# Altium project BV100011_UniversalSlave.PrjPCB (part 2 of 2)

## Sheet BV100011_SDCARD.SchDoc
size A
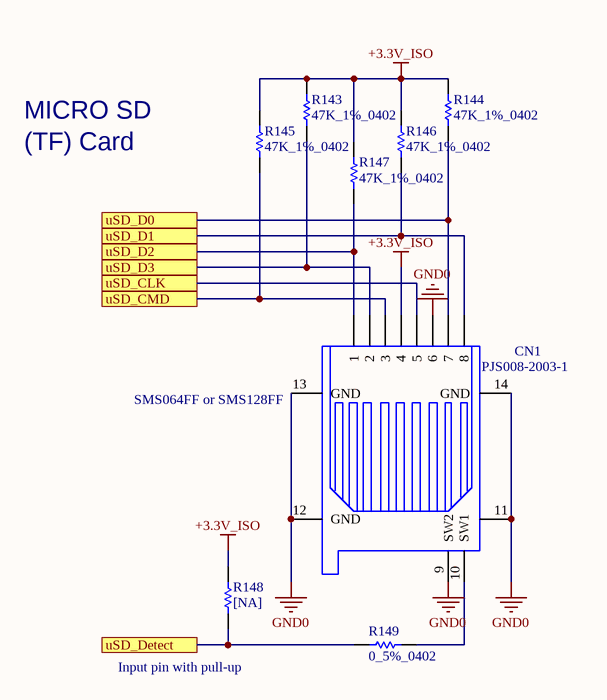
[diagram p9: BV100011_SDCARD.SchDoc]

### Parts
CN1  PJS008-2003-1  [PJS008-2003-1]
R143  47K_1%_0402  [0402R]
R144  47K_1%_0402  [0402R]
R145  47K_1%_0402  [0402R]
R146  47K_1%_0402  [0402R]
R147  47K_1%_0402  [0402R]
R148  [NA]  [0402R]
R149  0_5%_0402  [0402R]

### Ports
uSD_CLK, uSD_CMD, uSD_D0, uSD_D1, uSD_D2, uSD_D3, uSD_Detect

### Nets
+3.3V_ISO: CN1.4 R143.2 R144.2 R145.2 R146.2 R147.2 R148.2
GND0: CN1.6 CN1.9(SW2) CN1.11(GND) CN1.12(GND) CN1.13(GND) CN1.14(GND)
PC8: CN1.7 R144.1 ; port uSD_D0
PC9: CN1.8 R146.1 ; port uSD_D1
PC10: CN1.1 R147.1 ; port uSD_D2
PC11: CN1.2 R143.1 ; port uSD_D3
PC12: CN1.5 ; port uSD_CLK
PD2: CN1.3 R145.1 ; port uSD_CMD
PD3: R148.1 R149.1 ; port uSD_Detect
NetCN1_10: CN1.10(SW1) R149.2

### Notes on the sheet
- MICRO SD
- (TF) Card
- (near CN1) SMS064FF or SMS128FF
- (near R148) Input pin with pull-up

### Library data of the parts
CN1 = microSD-PJS008-2003: Memory Card Connectors MicroSD Card Conn Revrs Mnt Push-Push; Manuf_1: YAMAICHI; Manuf_Part_1: PJS008-2003-1; ECCN_US/EU: N/A; Order: PJS008-2003-1
R143-R147 = Res_47K_1%_0402: Resistor,47K,0402,1%,YAGEO; Manuf_Part_1: RC0402FR-0747KL; Order: 9239430; Value: 47K; Manuf_1: YAGEO; ECCN_US/EU: n/a; Distrib: FARNELL
R148 = Res_NA_0402: Resistor,[NA],0402; Fitted: NO; Value: [NA]; ECCN_US/EU: n/a
R149 = Res_0_5%_0402: Resistor,0,0402,5%,YAGEO; Manuf_Part_1: RC0402JR-070RL; Value: 0; Order: 2363467; ECCN_US/EU: n/a; Manuf_1: YAGEO; Distrib: FARNELL

## Sheet BV100011_Ethernet.SchDoc: Ethernet PHY with RJ45 connector
size A4; Date: 25-FEB-2015; Author: A.B; CompanyName: STMicroelectronics; Address1: 12, Rue Jules HOROWITZ; Address2: 38019 Grenoble; Address3: FRANCE; DocumentNumber: MB1191; Revision: B-02; SheetNumber: 12; SheetTotal: 14; Project: STM32F746G-DISCO
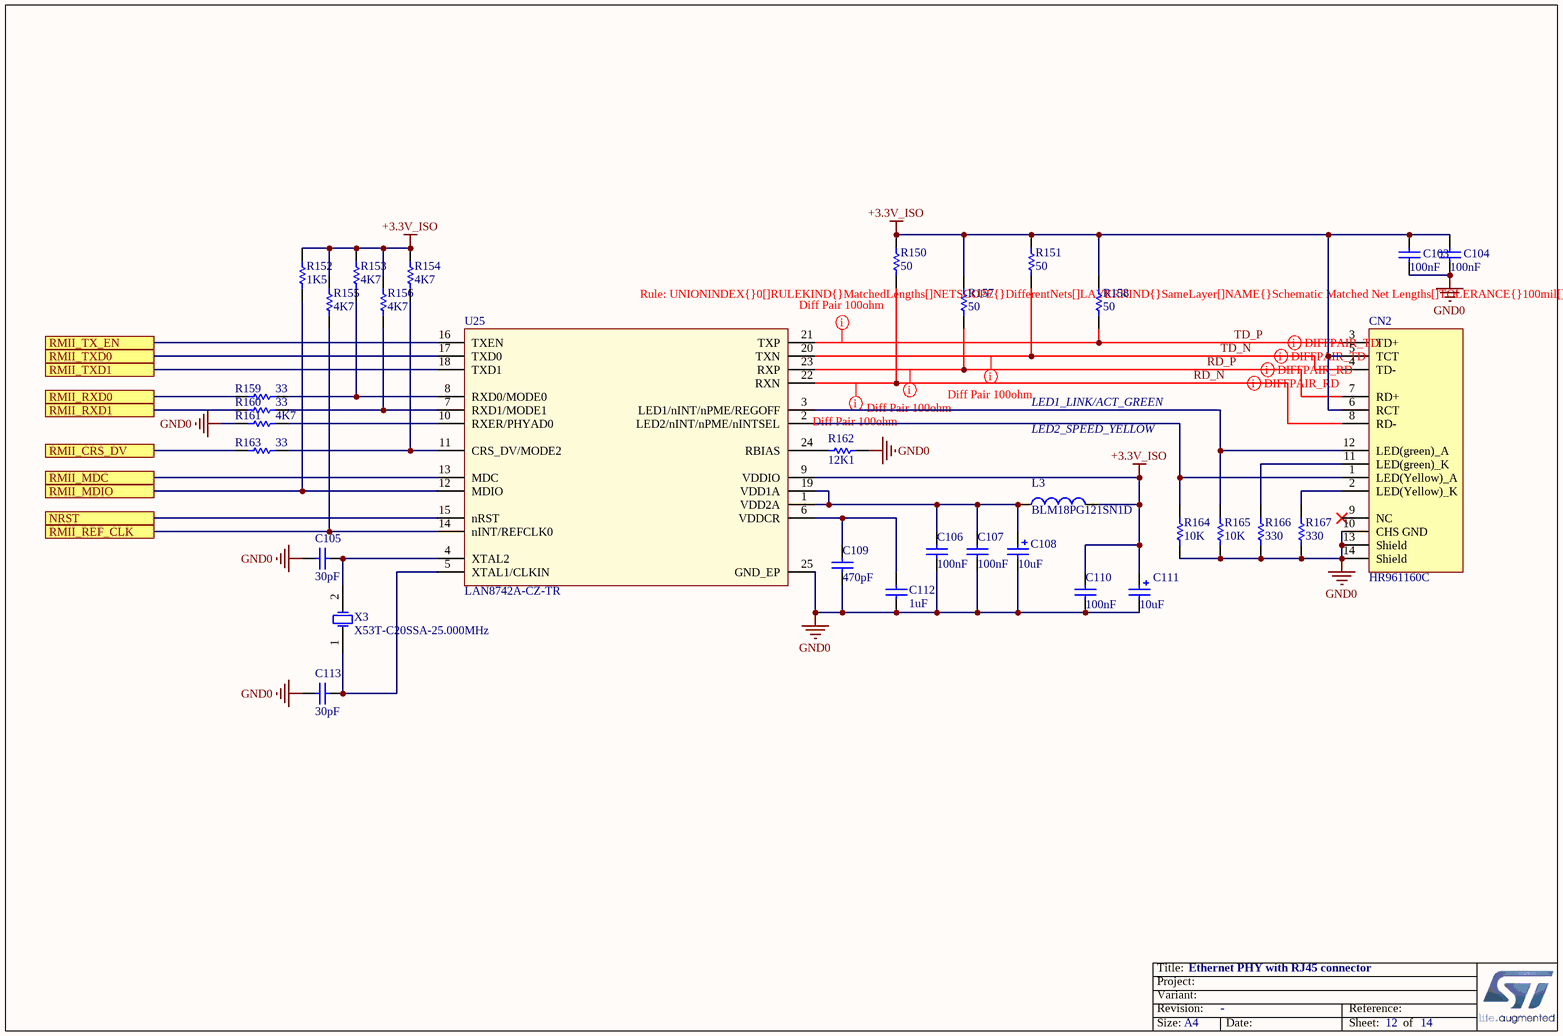
[diagram p10: BV100011_Ethernet.SchDoc]

### Parts
C103  100nF  [0402C]
C104  100nF  [0402C]
C105  30pF  [0603C]
C106  100nF  [0402C]
C107  100nF  [0402C]
C108  10uF  [TAN-A]
C109  470pF  [0402C]
C110  100nF  [0402C]
C111  10uF  [TAN-A]
C112  1uF  [0603C]
C113  30pF  [0603C]
CN2  HR961160C  [RJ45_HR961160C]
L3  BLM18PG121SN1D  [0603L]
R150  50  [0402R]
R151  50  [0402R]
R152  1K5  [0402R]
R153  4K7  [0402R]
R154  4K7  [0402R]
R155  4K7  [0402R]
R156  4K7  [0402R]
R157  50  [0402R]
R158  50  [0402R]
R159  33  [0402R]
R160  33  [0402R]
R161  4K7  [0402R]
R162  12K1  [0603R]
R163  33  [0402R]
R164  10K  [0402R]
R165  10K  [0402R]
R166  330  [0402R]
R167  330  [0402R]
U25  LAN8742A-CZ-TR  [QFN24_0R5_4X4]
X3  X53T-C20SSA-25.000MHz  [XTAL_2SM_5R0X3R2]

### Ports
NRST, RMII_CRS_DV, RMII_MDC, RMII_MDIO, RMII_REF_CLK, RMII_RXD0, RMII_RXD1, RMII_TX_EN, RMII_TXD0, RMII_TXD1

### Nets
+3.3V_ISO: C103.2 C104.2 C110.2 C111.1 CN2.5(TCT) CN2.6(RCT) L3.2 R150.1 R151.1 R152.2 R153.2 R154.2 R155.2 R156.2 R157.1 R158.1 U25.9(VDDIO)
GND0: C103.1 C104.1 C105.2 C106.1 C107.1 C108.2 C109.1 C110.1 C111.2 C112.1 C113.2 CN2.10(CHS_GND) CN2.13(Shield) CN2.14(Shield) R161.2 R162.2 R164.1 R165.1 R166.1 R167.1 U25.25(GND_EP)
NRST: U25.15(nRST) ; port NRST
PA1: R155.1 U25.14(nINT/REFCLK0) ; port RMII_REF_CLK
PA2: R152.1 U25.12(MDIO) ; port RMII_MDIO
PA7: R163.2 ; port RMII_CRS_DV
PB13: U25.18(TXD1) ; port RMII_TXD1
PC1: U25.13(MDC) ; port RMII_MDC
PC4: R159.2 ; port RMII_RXD0
PC5: R160.2 ; port RMII_RXD1
PG11: U25.16(TXEN) ; port RMII_TX_EN
PG13: U25.17(TXD0) ; port RMII_TXD0
RD_N: CN2.8(RD-) R150.2 U25.22(RXN)
RD_P: CN2.7(RD+) R157.2 U25.23(RXP)
TD_N: CN2.4(TD-) R151.2 U25.20(TXN)
TD_P: CN2.3(TD+) R158.2 U25.21(TXP)
NetC105_1: C105.1 U25.4(XTAL2) X3.2(OSC2)
NetC106_2: C106.2 C107.2 C108.1 L3.1 U25.1(VDD2A) U25.19(VDD1A)
NetC109_2: C109.2 C112.2 U25.6(VDDCR)
NetC113_1: C113.1 U25.5(XTAL1/CLKIN) X3.1(OSC1)
NetCN2_1: CN2.1(LED(Yellow)_A) R164.2 U25.2(LED2/nINT/nPME/nINTSEL)
NetCN2_2: CN2.2(LED(Yellow)_K) R167.2
NetCN2_11: CN2.11(LED(green)_K) R166.2
NetCN2_12: CN2.12(LED(green)_A) R165.2 U25.3(LED1/nINT/nPME/REGOFF)
NetR153_1: R153.1 R159.1 U25.8(RXD0/MODE0)
NetR154_1: R154.1 R163.1 U25.11(CRS_DV/MODE2)
NetR156_1: R156.1 R160.1 U25.7(RXD1/MODE1)
NetR161_1: R161.1 U25.10(RXER/PHYAD0)
NetR162_1: R162.1 U25.24(RBIAS)

Not connected (* = marked no-connect by the designer): CN2 9(NC)*

### Layout directives
differential pair: RD_N, RD_P, TD_N, TD_P
rule Matched Net Lengths [Tolerance = 100mil]: RD_N, RD_P, TD_N, TD_P

### Notes on the sheet
- LED2_SPEED_YELLOW
- LED1_LINK/ACT_GREEN
- Title:
- Project:
- Size:
- Revision:
- Variant:
- A4
- -
- Date:
- Reference:
- Sheet:
- of

### Library data of the parts
C103 C104 C106 C107 C110 = Cap_100nF_X7R_10%_0402: Capacitor,100nF,16V,X7R,10%,0402,YAGEO; Manuf_Part_1: CC0402KRX7R7BB104; Revision: July-2002: Re-released for DXP Platform.; Value: 100nF; Order: CC0402KRX7R7BB104; Manuf_1: YAGEO
C105 C113 = Capacitor_ST: Capacitor 0402 / 0603 / 0805; Value: 100nF; Revision: July-2002: Re-released for DXP Platform.
C108 C111 = Cap_10uF_POL_10%_TANA: Polarized Capacitor,10uF,10V,10%,typeA,VISHAY; Manuf_Part_1: 293D106X9010A2TE3; Revision: July-2002: Re-released for DXP Platform.; Value: 10uF; Manuf_1: VISHAY; Order: *; ECCN_US/EU: n/a
C109 = Cap_470pF_X7R_10%_0402: Capacitor,470pF,16V,X7R,10%,0402,YAGEO; Manuf_Part_1: 0402YC471KAT4A; Manuf_1: AVX; Revision: July-2002: Re-released for DXP Platform.; Value: 470pF; Order: 0402YC471KAT4A; ECCN_US/EU: n/a
C112 = Cap_1uF_X5R_10%_0603: Capacitor,1uF,16V,X5R,10%,0603,YAGEO; Manuf_Part_1: CC0603KRX5R7BB105; Revision: July-2002: Re-released for DXP Platform.; Value: 1uF; Order: CC0603KRX5R7BB105; Manuf_1: YAGEO; ECCN_US/EU: n/a
CN2 = HR961160C: 100 Base-TX (Fast Ethernet) SMD RJ45 single port (1x1) with LEDS Integrated Magnetics Connector; Manuf_1: HanRun; Manuf_2: Pulse Electronics Corporation; Manuf_Part_2: J3011G21DNLT; Manuf_3: K.O.D International Holding; Manuf_Part_3: RMT-119A-12F6-GY-04; Distrib: Sub Co; Manuf_Part_1: HR961160C; Order: *
L3 = BEAD_120R_2A_0603: Bead,120R,2A,0603,BLM18PG121SN1D,MURATA; Manuf_Part_3: FCM1608KF-601T03; Manuf_2: TDK; Manuf_Part_2: MPZ1608S300A; Manuf_3: Tai-tech; Value: 100uH; Description_3: Bead,600R,350mA,0603,FCM1608KF-601T03,Tai-tech; Description_2: Bead,30R,5A,0603,MPZ1608S300A,TDK; Revision: July-2002: Re-released for DXP Platform.; ECCN_US/EU: n/a; Manuf_Part_1: BLM18PG121SN1D; Manuf_1: MURATA
R150 R151 R157 R158 = Res_50_1%_0402: Resistor,50,0402,1%,YAGEO; Manuf_Part_1: RC0402FR-0749R9L; Value: 49.9; Manuf_1: YAGEO; Order: *; ECCN_US/EU: n/a; Distrib: FARNELL
R152 = Res_1K5_1%_0402: Resistor,1K5,0402,1%,YAGEO; Manuf_Part_1: RC0402FR-071K5L; Value: 1K5; Manuf_1: YAGEO; Order: RC0402FR-071K5L; ECCN_US/EU: n/a; Distrib: FARNELL
R153-R156 R161 = Res_4K7_1%_0402: Resistor,4K7,0402,1%,YAGEO; Manuf_Part_1: RT0402FRE074K7L; Value: 4K7; Manuf_1: YAGEO; Order: RT0402FRE074K7L; ECCN_US/EU: n/a
R159 R160 R163 = Res_33_1%_0402: Resistor,33,0402,1%,YAGEO; Manuf_Part_1: RC0402FR-0733RL; Value: 33; Manuf_1: YAGEO; Order: *; ECCN_US/EU: n/a; Distrib: FARNELL
R162 = Res_12K1_1%_0603: Resistor,12K1,0603,1%,VISHAY; Manuf_Part_1: MCT 0603-50 1% P5 12K1; Order: 2325243; Value: 12K1; ECCN_US/EU: n/a; Manuf_1: VISHAY; Distrib: FARNELL
R164 R165 = Res_10K_1%_0402: Resistor,10K,0402,1%,YAGEO; Manuf_Part_1: RC0402FR-0710KL; Value: 10K; Manuf_1: YAGEO; Order: RC0402FR-0710KL; ECCN_US/EU: n/a
R166 R167 = Res_330_1%_0402: Resistor,330,0402,1%,YAGEO; Manuf_Part_1: RC0402FR-07330RL; Value: 330; ECCN_US/EU: n/a; Manuf_1: YAGEO; Distrib: DIGIKEY; Order: RC0402FR-07330RL
U25 = LAN8742A-CZ-TR: LAN8742A-CZ-TR - Small Footprint RMII 10/100 Ethernet, Transceiver with HP Auto-MDIX and flexPWR Technology SQFN-24; Manuf_1: MICROCHIP; Order: LAN8742A-CZ-TR; Manuf_Part_1: LAN8742A-CZ-TR; Distrib: MICROCHIP
X3 = XTAL_5032: Crystal Oscillator; Published: 8-Jun-2000; LatestRevisionDate: 17-Jul-2002; LatestRevisionNote: Re-released for DXP Platform.; PackageReference: R38; Publisher: Altium Limited

## Sheet BV100011_DEBUG.SchDoc
size A4
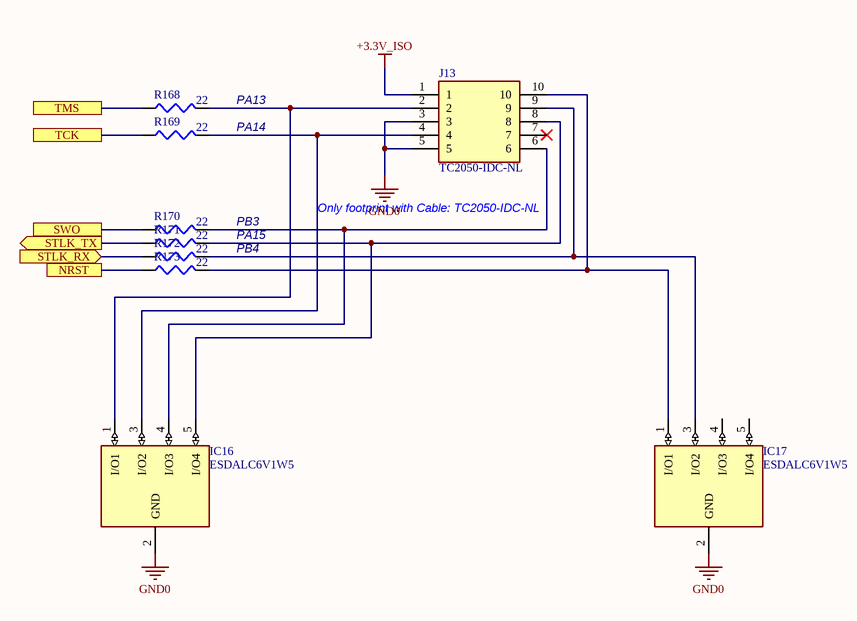
[diagram p11: BV100011_DEBUG.SchDoc]

### Parts
IC16  ESDALC6V1W5  [SOT65P210X110-5N]
IC17  ESDALC6V1W5  [SOT65P210X110-5N]
J13  TC2050-IDC-NL  [CON_TAG-C_TC2050-IDC-NL]
R168  22  [J1-0603]
R169  22  [J1-0603]
R170  22  [J1-0603]
R171  22  [J1-0603]
R172  22  [J1-0603]
R173  22  [J1-0603]

### Ports
NRST, STLK_RX (in), STLK_TX (out), SWO, TCK, TMS

### Nets
+3.3V_ISO: J13.1
GND0: IC16.2(GND) IC17.2(GND) J13.3 J13.5
NRST: R173.1 ; port NRST
PA13: R168.1 ; port TMS
PA14: R169.1 ; port TCK
PB3: R170.1 ; port SWO
PD8: R172.1 ; port STLK_RX
PD9: R171.1 ; port STLK_TX
NetIC16_1: IC16.1(I/O1) J13.2 R168.2
NetIC16_3: IC16.3(I/O2) J13.4 R169.2
NetIC16_4: IC16.4(I/O3) J13.6 R170.2
NetIC16_5: IC16.5(I/O4) J13.8 R171.2
NetIC17_1: IC17.1(I/O1) J13.10 R173.2
NetIC17_3: IC17.3(I/O2) J13.9 R172.2

Not connected (* = marked no-connect by the designer): IC17 4(I/O3) 5(I/O4); J13 7*

### Notes on the sheet
- PA13
- PA14
- PB3
- PA15
- PB4
- Only footprint with Cable: TC2050-IDC-NL

### Library data of the parts
IC16 IC17 = ESDALC6V1W5: Integrated Circuit; Manufacturer_Name: STMicroelectronics; Allied_Number: 70389952; Datasheet Link: http://www.st.com/web/en/resource/technical/document/datasheet/CD00002946.pdf; Height: 1.1mm; Manufacturer_Part_Number: ESDALC6V1W5; Mouser Part Number: 511-ESDALC6V1W5; Mouser Price/Stock: https://www.mouser.com/Search/Refine.aspx?Keyword=511-ESDALC6V1W5; RS Part Number: 0250044P; RS Price/Stock: http://uk.rs-online.com/web/p/products/0250044P; Allied Price/Stock: http://www.alliedelec.com/stmicroelectronics-esdalc6v1w5/70389952/
J13 = TC2050-IDC-NL: Plug-Of-Nailsâ„¢ Adapter Cable; MF: Tag-Connect LLC; MP: TC2050-IDC-NL; Availability: Unavailable; Package: None; Value: *; Price: None; SnapEDA_Link: https://www.snapeda.com/parts/TC2050-IDC-NL/Tag-Connect%20LLC/view-part/134534/?ref=snap
R168-R173 = Res3: Resistor; Published: 8-Jun-2000; LatestRevisionDate: 29-May-2009; LatestRevisionNote: IPC-7351 Footprint Added.; PackageReference: J1-0603; Publisher: Altium Limited; PackageDescription: Chip Resistor; Value: 22

## Sheet BV100011_EERAM.SchDoc
size A
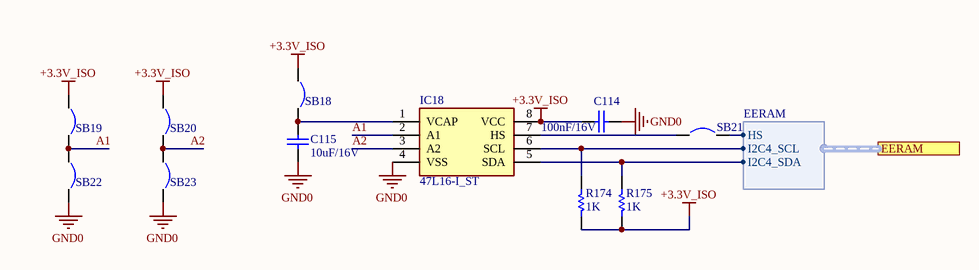
[diagram p12: BV100011_EERAM.SchDoc]

### Parts
C114  100nF/16V  [C1210]
C115  10uF/16V  [C1210]
IC18  47L16-I_ST  [SOP65P640X120-8N]
R174  1K  [0402R]
R175  1K  [0402R]
SB18  Circuit Breaker  [SB_0603]  (value not drawn)
SB19  Circuit Breaker  [SB_0603]  (value not drawn)
SB20  Circuit Breaker  [SB_0603]  (value not drawn)
SB21  Circuit Breaker  [SB_0603]  (value not drawn)
SB22  Circuit Breaker  [SB_0603]  (value not drawn)
SB23  Circuit Breaker  [SB_0603]  (value not drawn)

### Ports
EERAM (harness EERAM)

### Harnesses
EERAM: HS, I2C4_SCL, I2C4_SDA

### Nets
+3.3V_ISO: C114.2 IC18.8(VCC) R174.1 R175.1 SB18.1 SB19.1 SB20.1
GND0: C114.1 C115.1 IC18.4(VSS) SB22.2 SB23.2
A1: IC18.2(A1) SB19.2 SB22.1
A2: IC18.3(A2) SB20.2 SB23.1
PF13: SB21.2 ; port EERAM.HS
PF14: IC18.6(SCL) R174.2 ; port EERAM.I2C4_SCL
PF15: IC18.5(SDA) R175.2 ; port EERAM.I2C4_SDA
NetC115_2: C115.2 IC18.1(VCAP) SB18.2
NetIC18_7: IC18.7(HS) SB21.1

### Library data of the parts
C114 C115 = Cap Semi: Capacitor (Semiconductor SIM Model); Value: 2.2nF/50V; Published: 8-Jun-2000; LatestRevisionDate: 29-May-2009; LatestRevisionNote: IPC-7351 Footprint Added.; PackageReference: C1206; Publisher: Altium Limited; PackageDescription: Chip Capacitor
IC18 = 47L16-I_ST: Integrated Circuit; Manufacturer_Name: Microchip; Manufacturer_Part_Number: 47L16-I/ST; Datasheet Link: http://ww1.microchip.com/downloads/en/DeviceDoc/20005371C.pdf; Height: 1.2mm; Arrow Part Number: 47L16-I/ST; Arrow Price/Stock: https://www.arrow.com/en/products/47l16-ist/microchip-technology; Mouser Part Number: 579-47L16-I/ST; Mouser Price/Stock: https://www.mouser.co.uk/ProductDetail/Microchip-Technology/47L16-I-ST?qs=vH2uEH3KBjXyAWKjlRLYHg%3D%3D
R174 R175 = Res1: Resistor; Published: 8-Jun-2000; Revision: July-2002: Re-released for DXP Platform.; Publisher: Altium Limited; Value: 1K
SB18-SB23 = Circuit Breaker: Solder: NO; Published: 24-Mar-1999; Revision: July-2002: Re-released for DXP Platform.; Publisher: Altium Limited

## Sheet BV100011_MCU144.SchDoc: MCU
size A3; DocumentNumber: MB1137; Revision: B-01; SheetNumber: 2; SheetTotal: 6; Project: NUCLEO-XXXXZX
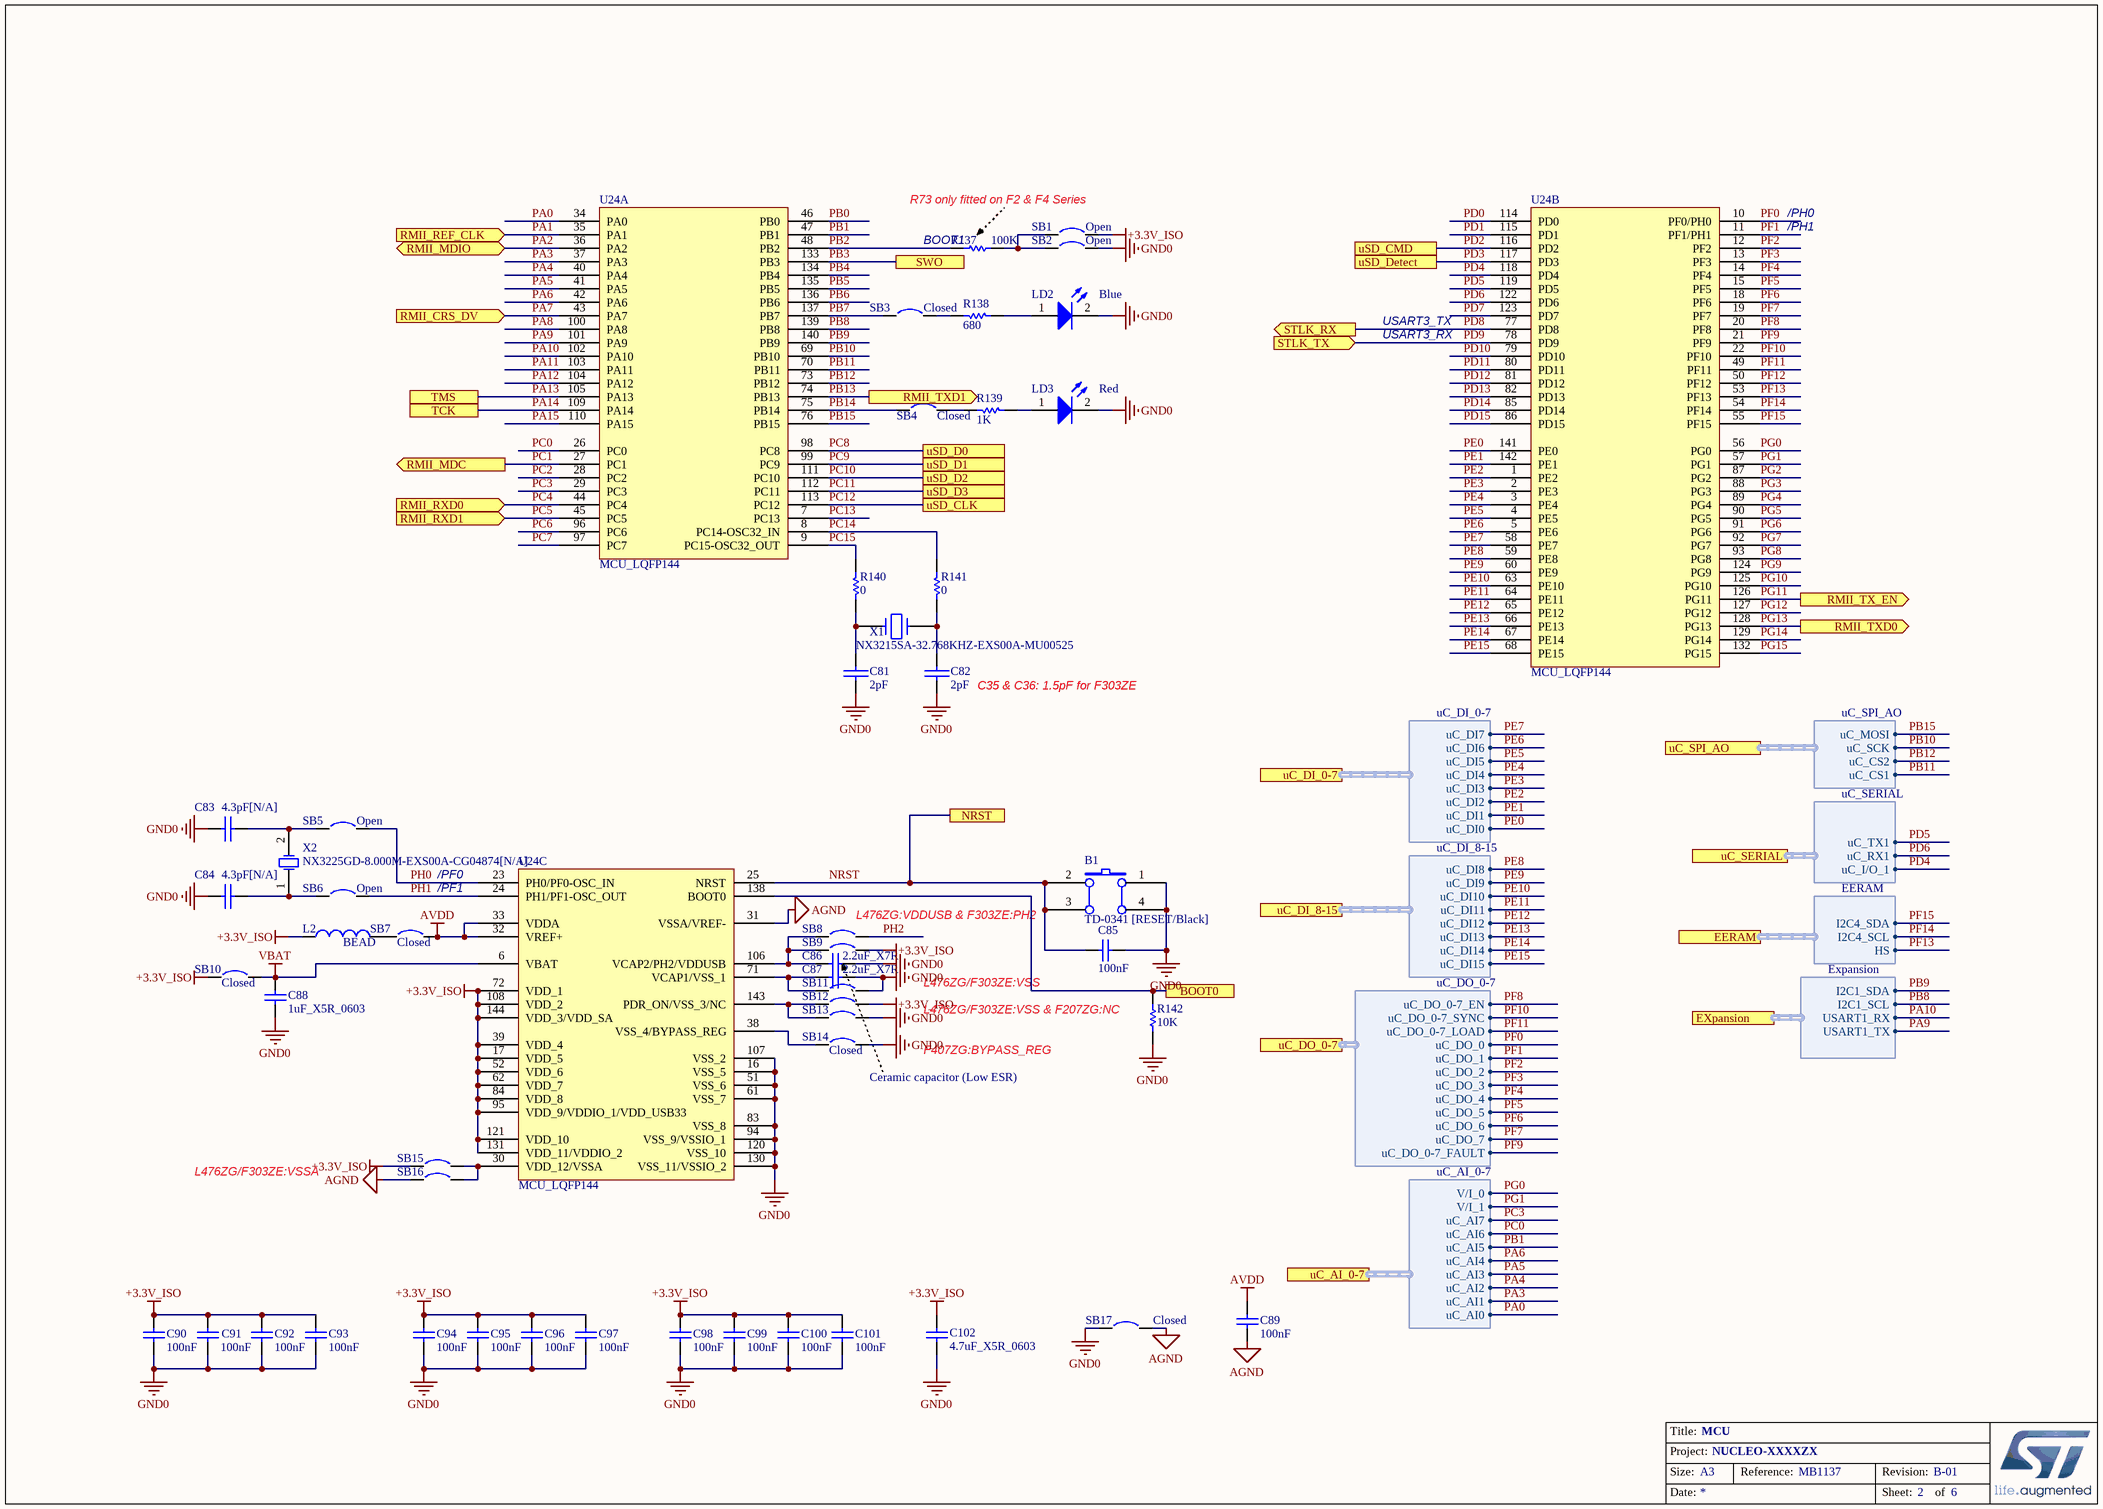
[diagram p13: BV100011_MCU144.SchDoc]

### Parts
B1  TD-0341 [RESET/Black]  [PB-6X6mm-Black]
C81  2pF  [0603C]
C82  2pF  [0603C]
C83  4.3pF[N/A]  [0603C]
C84  4.3pF[N/A]  [0603C]
C85  100nF  [0603C]
C86  2.2uF_X7R  [TAN-A]
C87  2.2uF_X7R  [TAN-A]
C88  1uF_X5R_0603  [0603C]
C89  100nF  [0603C]
C90  100nF  [0603C]
C91  100nF  [0603C]
C92  100nF  [0603C]
C93  100nF  [0603C]
C94  100nF  [0603C]
C95  100nF  [0603C]
C96  100nF  [0603C]
C97  100nF  [0603C]
C98  100nF  [0603C]
C99  100nF  [0603C]
C100  100nF  [0603C]
C101  100nF  [0603C]
C102  4.7uF_X5R_0603  [0603C]
L2  BEAD  [0603L]
LD2  Blue  [0603D-B]
LD3  Red  [0603D-R]
R137  100K  [0603R]
R138  680  [0603R]
R139  1K  [0603R]
R140  0  [0603R]
R141  0  [0603R]
R142  10K  [0603R]
SB1  Open  [SB_0603]
SB2  Open  [SB_0603]
SB3  Closed  [SB_0603]
SB4  Closed  [SB_0603]
SB5  Open  [SB_0603]
SB6  Open  [SB_0603]
SB7  Closed  [SB_0603]
SB8  Circuit Breaker  [SB_0603]  (value not drawn)
SB9  Circuit Breaker  [SB_0603]  (value not drawn)
SB10  Closed  [SB_0603]
SB11  Circuit Breaker  [SB_0603]  (value not drawn)
SB12  Circuit Breaker  [SB_0603]  (value not drawn)
SB13  Circuit Breaker  [SB_0603]  (value not drawn)
SB14  Closed  [SB_0603]
SB15  Circuit Breaker  [SB_0603]  (value not drawn)
SB16  Circuit Breaker  [SB_0603]  (value not drawn)
SB17  Closed  [SB_0603]
U24  MCU_LQFP144  [LQFP144_0R5_SKT]  (parts A,B,C of 3)
X1  NX3215SA-32.768KHZ-EXS00A-MU00525  [XTAL_2SM_3R2X1R5]
X2  NX3225GD-8.000M-EXS00A-CG04874[N/A]  [OSC_2SM_3R2x2R5]

### Ports
BOOT0, EERAM (harness EERAM), EXpansion (harness Expansion), NRST, RMII_CRS_DV (in), RMII_MDC (out), RMII_MDIO (bidir), RMII_REF_CLK (in), RMII_RXD0 (in), RMII_RXD1 (in), RMII_TX_EN (out), RMII_TXD0 (out), RMII_TXD1 (out), STLK_RX (out), STLK_TX (in), SWO, TCK, TMS, uC_AI_0-7 (harness uC_AI_0-7), uC_DI_0-7 (harness uC_DI_0-7), uC_DI_8-15 (harness uC_DI_8-15), uC_DO_0-7 (harness uC_DO_0-7), uC_SERIAL (harness uC_SERIAL), uC_SPI_AO (harness uC_SPI_AO), uSD_CLK, uSD_CMD, uSD_D0, uSD_D1, uSD_D2, uSD_D3, uSD_Detect

### Harnesses
uC_DI_0-7: uC_DI7, uC_DI6, uC_DI5, uC_DI4, uC_DI3, uC_DI2, uC_DI1, uC_DI0
uC_DI_8-15: uC_DI8, uC_DI9, uC_DI10, uC_DI11, uC_DI12, uC_DI13, uC_DI14, uC_DI15
uC_DO_0-7: uC_DO_0-7_EN, uC_DO_0-7_SYNC, uC_DO_0-7_LOAD, uC_DO_0, uC_DO_1, uC_DO_2, uC_DO_3, uC_DO_4, uC_DO_5, uC_DO_6, uC_DO_7, uC_DO_0-7_FAULT
uC_SPI_AO: uC_CS1, uC_CS2, uC_SCK, uC_MOSI
uC_SERIAL: uC_TX1, uC_RX1, uC_I/O_1
uC_AI_0-7: uC_AI0, uC_AI1, uC_AI2, uC_AI3, uC_AI4, uC_AI5, uC_AI6, uC_AI7, V/I_0, V/I_1
EERAM: HS, I2C4_SCL, I2C4_SDA
Expansion: I2C1_SDA, I2C1_SCL, USART1_RX, USART1_TX

### Nets
+3.3V_ISO: C90.1 C91.1 C92.1 C93.1 C94.1 C95.1 C96.1 C97.1 C98.1 C99.1 C100.1 C101.1 C102.1 L2.1 SB1.2 SB9.2 SB10.1 SB12.2 SB15.1 U24.17(VDD_5) U24.39(VDD_4) U24.52(VDD_6) U24.62(VDD_7) U24.72(VDD_1) U24.84(VDD_8) U24.95(VDD_9/VDDIO_1/VDD_USB33) U24.108(VDD_2) U24.121(VDD_10) U24.131(VDD_11/VDDIO_2) U24.144(VDD_3/VDD_SA)
AGND: C89.2 SB16.1 SB17.2 U24.31(VSSA/VREF-)
AVDD: C89.1 SB7.2 U24.32(VREF+) U24.33(VDDA)
GND0: B1.1(A0) B1.4(A1) C81.2 C82.2 C83.2 C84.2 C85.1 C86.2 C87.2 C88.2 C90.2 C91.2 C92.2 C93.2 C94.2 C95.2 C96.2 C97.2 C98.2 C99.2 C100.2 C101.2 C102.2 LD2.2(K) LD3.2(K) R142.2 SB2.2 SB11.2 SB13.2 SB14.2 SB17.1 U24.16(VSS_5) U24.51(VSS_6) U24.61(VSS_7) U24.83(VSS_8) U24.94(VSS_9/VSSIO_1) U24.107(VSS_2) U24.120(VSS_10) U24.130(VSS_11/VSSIO_2)
VBAT: C88.1 SB10.2 U24.6(VBAT)
NRST: B1.2(B0) B1.3(B1) C85.2 U24.25(NRST) ; port NRST
PA0: U24.34(PA0) ; port uC_AI_0-7.uC_AI0
PA1: U24.35(PA1) ; port RMII_REF_CLK
PA2: U24.36(PA2) ; port RMII_MDIO
PA3: U24.37(PA3) ; port uC_AI_0-7.uC_AI1
PA4: U24.40(PA4) ; port uC_AI_0-7.uC_AI2
PA5: U24.41(PA5) ; port uC_AI_0-7.uC_AI3
PA6: U24.42(PA6) ; port uC_AI_0-7.uC_AI4
PA7: U24.43(PA7) ; port RMII_CRS_DV
PA8: U24.100(PA8)
PA9: U24.101(PA9) ; port EXpansion.USART1_TX
PA10: U24.102(PA10) ; port EXpansion.USART1_RX
PA11: U24.103(PA11)
PA12: U24.104(PA12)
PA13: U24.105(PA13) ; port TMS
PA14: U24.109(PA14) ; port TCK
PA15: U24.110(PA15)
PB0: U24.46(PB0)
PB1: U24.47(PB1) ; port uC_AI_0-7.uC_AI5
PB2: R137.1 U24.48(PB2)
PB3: U24.133(PB3) ; port SWO
PB4: U24.134(PB4)
PB5: U24.135(PB5)
PB6: U24.136(PB6)
PB7: SB3.1 U24.137(PB7)
PB8: U24.139(PB8) ; port EXpansion.I2C1_SCL
PB9: U24.140(PB9) ; port EXpansion.I2C1_SDA
PB10: U24.69(PB10) ; port uC_SPI_AO.uC_SCK
PB11: U24.70(PB11) ; port uC_SPI_AO.uC_CS1
PB12: U24.73(PB12) ; port uC_SPI_AO.uC_CS2
PB13: U24.74(PB13) ; port RMII_TXD1
PB14: SB4.1 U24.75(PB14)
PB15: U24.76(PB15) ; port uC_SPI_AO.uC_MOSI
PC0: U24.26(PC0) ; port uC_AI_0-7.uC_AI6
PC1: U24.27(PC1) ; port RMII_MDC
PC2: U24.28(PC2)
PC3: U24.29(PC3) ; port uC_AI_0-7.uC_AI7
PC4: U24.44(PC4) ; port RMII_RXD0
PC5: U24.45(PC5) ; port RMII_RXD1
PC6: U24.96(PC6)
PC7: U24.97(PC7)
PC8: U24.98(PC8) ; port uSD_D0
PC9: U24.99(PC9) ; port uSD_D1
PC10: U24.111(PC10) ; port uSD_D2
PC11: U24.112(PC11) ; port uSD_D3
PC12: U24.113(PC12) ; port uSD_CLK
PC13: U24.7(PC13)
PC14: R141.2 U24.8(PC14-OSC32_IN)
PC15: R140.2 U24.9(PC15-OSC32_OUT)
PD0: U24.114(PD0)
PD1: U24.115(PD1)
PD2: U24.116(PD2) ; port uSD_CMD
PD3: U24.117(PD3) ; port uSD_Detect
PD4: U24.118(PD4) ; port uC_SERIAL.uC_I/O_1
PD5: U24.119(PD5) ; port uC_SERIAL.uC_TX1
PD6: U24.122(PD6) ; port uC_SERIAL.uC_RX1
PD7: U24.123(PD7)
PD8: U24.77(PD8) ; port STLK_RX
PD9: U24.78(PD9) ; port STLK_TX
PD10: U24.79(PD10)
PD11: U24.80(PD11)
PD12: U24.81(PD12)
PD13: U24.82(PD13)
PD14: U24.85(PD14)
PD15: U24.86(PD15)
PE0: U24.141(PE0) ; port uC_DI_0-7.uC_DI0
PE1: U24.142(PE1) ; port uC_DI_0-7.uC_DI1
PE2: U24.1(PE2) ; port uC_DI_0-7.uC_DI2
PE3: U24.2(PE3) ; port uC_DI_0-7.uC_DI3
PE4: U24.3(PE4) ; port uC_DI_0-7.uC_DI4
PE5: U24.4(PE5) ; port uC_DI_0-7.uC_DI5
PE6: U24.5(PE6) ; port uC_DI_0-7.uC_DI6
PE7: U24.58(PE7) ; port uC_DI_0-7.uC_DI7
PE8: U24.59(PE8) ; port uC_DI_8-15.uC_DI8
PE9: U24.60(PE9) ; port uC_DI_8-15.uC_DI9
PE10: U24.63(PE10) ; port uC_DI_8-15.uC_DI10
PE11: U24.64(PE11) ; port uC_DI_8-15.uC_DI11
PE12: U24.65(PE12) ; port uC_DI_8-15.uC_DI12
PE13: U24.66(PE13) ; port uC_DI_8-15.uC_DI13
PE14: U24.67(PE14) ; port uC_DI_8-15.uC_DI14
PE15: U24.68(PE15) ; port uC_DI_8-15.uC_DI15
PF0: U24.10(PF0/PH0) ; port uC_DO_0-7.uC_DO_0
PF1: U24.11(PF1/PH1) ; port uC_DO_0-7.uC_DO_1
PF2: U24.12(PF2) ; port uC_DO_0-7.uC_DO_2
PF3: U24.13(PF3) ; port uC_DO_0-7.uC_DO_3
PF4: U24.14(PF4) ; port uC_DO_0-7.uC_DO_4
PF5: U24.15(PF5) ; port uC_DO_0-7.uC_DO_5
PF6: U24.18(PF6) ; port uC_DO_0-7.uC_DO_6
PF7: U24.19(PF7) ; port uC_DO_0-7.uC_DO_7
PF8: U24.20(PF8) ; port uC_DO_0-7.uC_DO_0-7_EN
PF9: U24.21(PF9) ; port uC_DO_0-7.uC_DO_0-7_FAULT
PF10: U24.22(PF10) ; port uC_DO_0-7.uC_DO_0-7_SYNC
PF11: U24.49(PF11) ; port uC_DO_0-7.uC_DO_0-7_LOAD
PF12: U24.50(PF12)
PF13: U24.53(PF13) ; port EERAM.HS
PF14: U24.54(PF14) ; port EERAM.I2C4_SCL
PF15: U24.55(PF15) ; port EERAM.I2C4_SDA
PG0: U24.56(PG0) ; port uC_AI_0-7.V/I_0
PG1: U24.57(PG1) ; port uC_AI_0-7.V/I_1
PG2: U24.87(PG2)
PG3: U24.88(PG3)
PG4: U24.89(PG4)
PG5: U24.90(PG5)
PG6: U24.91(PG6)
PG7: U24.92(PG7)
PG8: U24.93(PG8)
PG9: U24.124(PG9)
PG10: U24.125(PG10)
PG11: U24.126(PG11) ; port RMII_TX_EN
PG12: U24.127(PG12)
PG13: U24.128(PG13) ; port RMII_TXD0
PG14: U24.129(PG14)
PG15: U24.132(PG15)
PH0: SB5.2 U24.23(PH0/PF0-OSC_IN)
PH1: SB6.2 U24.24(PH1/PF1-OSC_OUT)
PH2: SB8.2
NetC81_1: C81.1 R140.1 X1.1
NetC82_1: C82.1 R141.1 X1.2
NetC83_1: C83.1 SB5.1 X2.2(OSC2)
NetC84_1: C84.1 SB6.1 X2.1(OSC1)
NetC86_1: C86.1 SB8.1 SB9.1 U24.106(VCAP2/PH2/VDDUSB)
NetC87_1: C87.1 SB11.1 U24.71(VCAP1/VSS_1)
NetL2_2: L2.2 SB7.1
NetLD2_1: LD2.1(A) R138.2
NetLD3_1: LD3.1(A) R139.2
NetR137_2: R137.2 SB1.1 SB2.1
NetR138_1: R138.1 SB3.2
NetR139_1: R139.1 SB4.2
NetR142_1: R142.1 U24.138(BOOT0) ; port BOOT0
NetSB12_1: SB12.1 SB13.1 U24.143(PDR_ON/VSS_3/NC)
NetSB14_1: SB14.1 U24.38(VSS_4/BYPASS_REG)
NetSB15_2: SB15.2 SB16.2 U24.30(VDD_12/VSSA)

### Notes on the sheet
- R73 only fitted on F2 & F4 Series
- (near R137) BOOT1
- /PH0
- /PH1
- USART3_TX
- USART3_RX
- (near C82) C35 & C36: 1.5pF for F303ZE
- /PF0
- /PF1
- (near SB8) L476ZG:VDDUSB & F303ZE:PH2
- L476ZG/F303ZE:VSS
- L476ZG/F303ZE:VSS & F207ZG:NC
- F407ZG:BYPASS_REG
- (near SB14) Ceramic capacitor (Low ESR)
- L476ZG/F303ZE:VSSA
- Title:
- Project:
- Size:
- Date:
- A3
- Reference:
- Sheet:
- Revision:
- of

### Library data of the parts
B1 = SW PUSHBUTTON: SE PUSHBUTTON
C81-C84 = CAP: Capacitor
C85 = CAP: Capacitor; Value: 100pF; Published: 8-Jun-2000; Revision: July-2002: Re-released for DXP Platform.; Publisher: Altium Limited
C86 C87 = Cap_2.2uF_X7R_10%_0805: Capacitor,2.2uF,16V, X7R,10%,0805,YAGEO; Manuf_Part_1: CC0805KKX7R7BB225; Revision: July-2002: Re-released for DXP Platform.; Value: 2.2uF; Order: CC0805KKX7R7BB225; Manuf_1: YAGEO
C88 = CAP SMD 0603  X5R 1µF 25V 10%: 0603  X5R 1µF; Rated voltage: 25V; Tolerance: 10%; Manufacturer: *; Manufacturer P/N: *; Order code Farnell: 1288202RL; Value: 1µF; Power: *; Technology: X5R; Temperature  Factor: *; Temperature Max: +125°C; Temperature Min: -55°C; STS Code: *
C89-C101 = Cap: Capacitor; Value: 10nF; Published: 8-Jun-2000; Revision: July-2002: Re-released for DXP Platform.; Publisher: Altium Limited
C102 = CAP SMD 0603  X5R 1µF 25V 10%: 0603  X5R 4.7uF; Value: 1µF; Rated voltage: 25V; Tolerance: 10%; Manufacturer: *; Manufacturer P/N: *; Order code Farnell: 1288202RL; Power: *; Technology: X5R; Temperature  Factor: *; Temperature Max: +125°C; Temperature Min: -55°C; STS Code: *
L2 = Inductor: Value: 100uH; Published: 8-Jun-2000; Revision: July-2002: Re-released for DXP Platform.; Publisher: Altium Limited
LD2 LD3 = LED2: Typical RED, GREEN, YELLOW, AMBER GaAs LED; Published: 8-Jun-2000; Revision: July-2002: Re-released for DXP Platform.; Publisher: Altium Limited
R137 R142 = res1: Resistor; Value: 1K; Published: 8-Jun-2000; Revision: July-2002: Re-released for DXP Platform.; Publisher: Altium Limited
R138 R140 R141 = Res1: Resistor; Value: 1K; Published: 8-Jun-2000; Revision: July-2002: Re-released for DXP Platform.; Publisher: Altium Limited
R139 = Res1: Resistor; Published: 8-Jun-2000; Revision: July-2002: Re-released for DXP Platform.; Publisher: Altium Limited; Value: 1K
SB1 SB2 SB5 SB6 = Circuit Breaker: Published: 24-Mar-1999; Revision: July-2002: Re-released for DXP Platform.; Publisher: Altium Limited
SB3 SB4 SB7 SB10 SB14 SB17 = Circuit Breaker_close: Circuit Breaker; Published: 24-Mar-1999; Revision: July-2002: Re-released for DXP Platform.; Publisher: Altium Limited
SB8 SB9 SB11-SB13 SB15 SB16 = Circuit Breaker: Solder: NO; Published: 24-Mar-1999; Revision: July-2002: Re-released for DXP Platform.; Publisher: Altium Limited
X1 = CRYSTAL_32K: Crystal
X2 = XTAL: Crystal Oscillator; Published: 8-Jun-2000; LatestRevisionDate: 17-Jul-2002; LatestRevisionNote: Re-released for DXP Platform.; PackageReference: R38; Publisher: Altium Limited

## Sheet BV100011_ControlConnector.SchDoc
size B
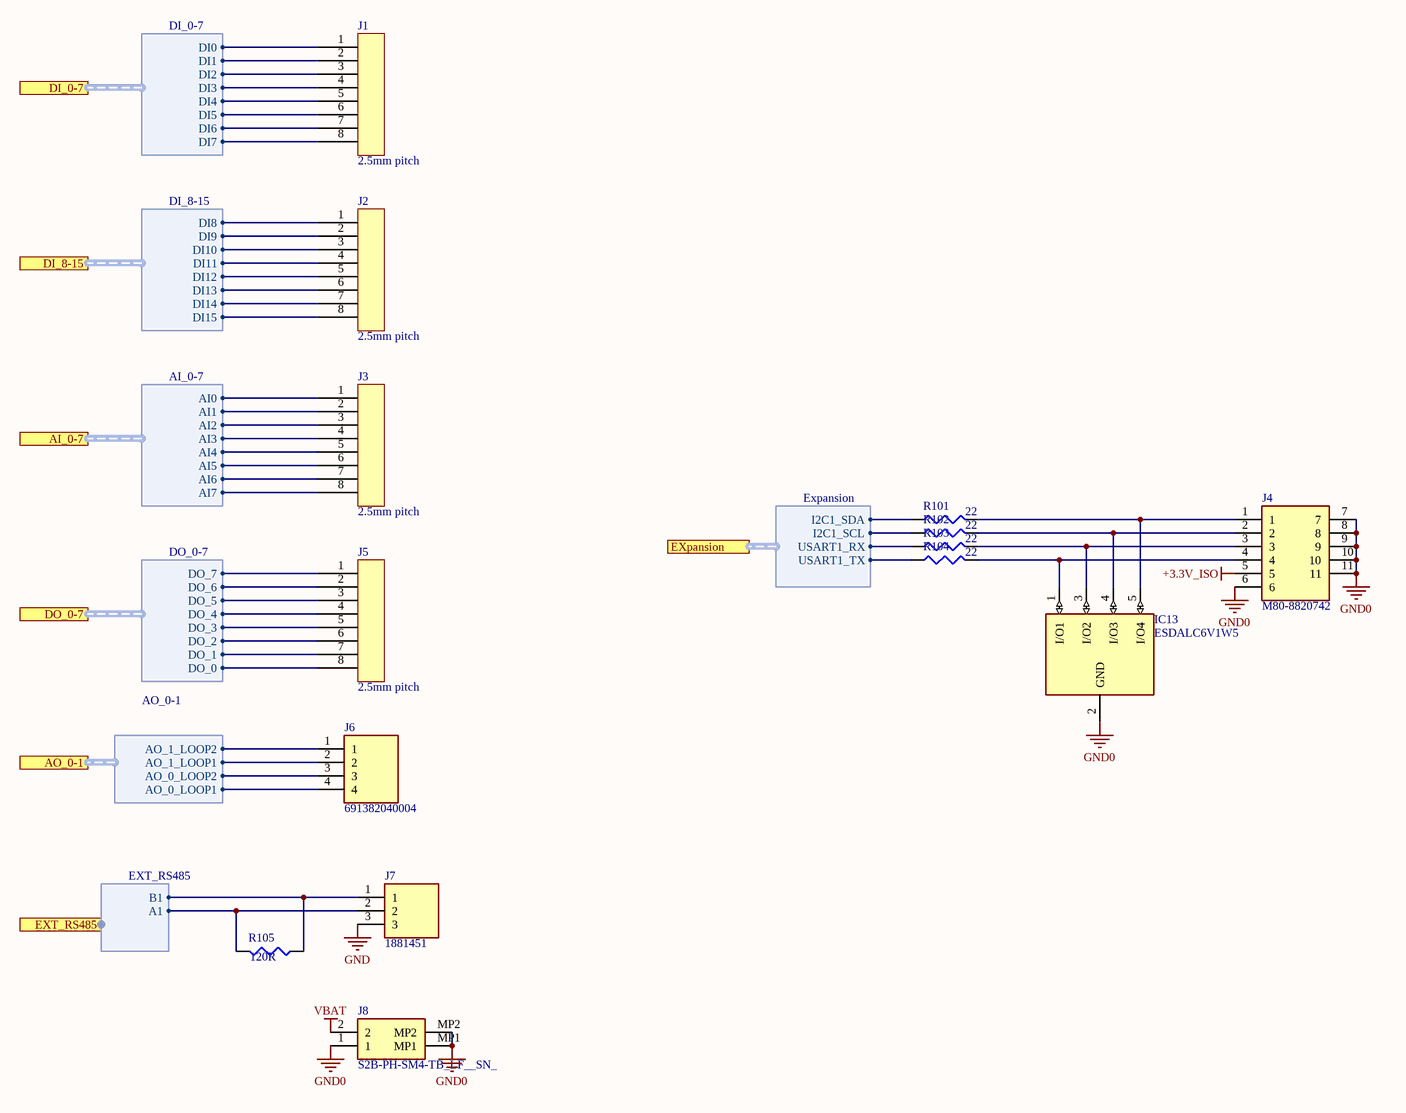
[diagram p14: BV100011_ControlConnector.SchDoc]

### Parts
IC13  ESDALC6V1W5  [SOT65P210X110-5N]
J1  2.5mm pitch  [2.5mm pitch]
J2  2.5mm pitch  [2.5mm pitch]
J3  2.5mm pitch  [2.5mm pitch]
J4  M80-8820742  [M80-8820742]
J5  2.5mm pitch  [2.5mm pitch]
J6  691382040004  [SHDRRA4W80P0X250_1X4_2200X1010X810P]
J7  1881451  [SHDR3W100P0X250_1X3_940X1010X810P]
J8  S2B-PH-SM4-TB_LF__SN_  [S2BPHSM4TBLFSN]
R101  22  [J1-0603]
R102  22  [J1-0603]
R103  22  [J1-0603]
R104  22  [J1-0603]
R105  120R  [14-1210]

### Ports
AI_0-7 (harness AI_0-7), AO_0-1 (harness AO_0-1), DI_0-7 (harness DI_0-7), DI_8-15 (harness DI_8-15), DO_0-7 (harness DO_0-7), EXpansion (harness Expansion), EXT_RS485 (harness EXT_RS485)

### Harnesses
DI_0-7: DI0, DI1, DI2, DI3, DI4, DI5, DI6, DI7
AI_0-7: AI0, AI1, AI2, AI3, AI4, AI5, AI6, AI7
DO_0-7: DO_7, DO_6, DO_5, DO_4, DO_3, DO_2, DO_1, DO_0
AO_0-1: AO_0_LOOP1, AO_0_LOOP2, AO_1_LOOP1, AO_1_LOOP2
EXT_RS485: A1, B1
DI_8-15: DI8, DI9, DI10, DI11, DI12, DI13, DI14, DI15
Expansion: I2C1_SDA, I2C1_SCL, USART1_RX, USART1_TX

### Nets
+3.3V_ISO: J4.5
GND: J7.3
GND0: IC13.2(GND) J4.6 J4.7 J4.8 J4.9 J4.10 J4.11 J8.1 J8.MP1 J8.MP2
VBAT: J8.2
AI0: J3.1 ; port AI_0-7.AI0
AI1: J3.2 ; port AI_0-7.AI1
AI2: J3.3 ; port AI_0-7.AI2
AI3: J3.4 ; port AI_0-7.AI3
AI4: J3.5 ; port AI_0-7.AI4
AI5: J3.6 ; port AI_0-7.AI5
AI6: J3.7 ; port AI_0-7.AI6
AI7: J3.8 ; port AI_0-7.AI7
DI0: J1.1 ; port DI_0-7.DI0
DI1: J1.2 ; port DI_0-7.DI1
DI2: J1.3 ; port DI_0-7.DI2
DI3: J1.4 ; port DI_0-7.DI3
DI4: J1.5 ; port DI_0-7.DI4
DI5: J1.6 ; port DI_0-7.DI5
DI6: J1.7 ; port DI_0-7.DI6
DI7: J1.8 ; port DI_0-7.DI7
DI8: J2.1 ; port DI_8-15.DI8
DI9: J2.2 ; port DI_8-15.DI9
DI10: J2.3 ; port DI_8-15.DI10
DI11: J2.4 ; port DI_8-15.DI11
DI12: J2.5 ; port DI_8-15.DI12
DI13: J2.6 ; port DI_8-15.DI13
DI14: J2.7 ; port DI_8-15.DI14
DI15: J2.8 ; port DI_8-15.DI15
PA9: R104.1 ; port EXpansion.USART1_TX
PA10: R103.1 ; port EXpansion.USART1_RX
PB8: R102.1 ; port EXpansion.I2C1_SCL
PB9: R101.1 ; port EXpansion.I2C1_SDA
NetC15_2: J5.5 ; port DO_0-7.DO_3
NetC17_2: J5.6 ; port DO_0-7.DO_2
NetC18_2: J5.7 ; port DO_0-7.DO_1
NetC19_2: J5.8 ; port DO_0-7.DO_0
NetC20_1: J5.1 ; port DO_0-7.DO_7
NetC22_1: J5.2 ; port DO_0-7.DO_6
NetC24_1: J5.3 ; port DO_0-7.DO_5
NetC26_1: J5.4 ; port DO_0-7.DO_4
NetD19_2: J6.4 ; port AO_0-1.AO_0_LOOP1
NetD22_2: J6.3 ; port AO_0-1.AO_0_LOOP2
NetD24_2: J6.2 ; port AO_0-1.AO_1_LOOP1
NetD27_2: J6.1 ; port AO_0-1.AO_1_LOOP2
NetD38_1: J7.2 R105.2 ; port EXT_RS485.A1
NetD38_2: J7.1 R105.1 ; port EXT_RS485.B1
NetIC13_1: IC13.1(I/O1) J4.4 R104.2
NetIC13_3: IC13.3(I/O2) J4.3 R103.2
NetIC13_4: IC13.4(I/O3) J4.2 R102.2
NetIC13_5: IC13.5(I/O4) J4.1 R101.2

### Library data of the parts
IC13 = ESDALC6V1W5: Integrated Circuit; Manufacturer_Name: STMicroelectronics; Allied_Number: 70389952; Datasheet Link: http://www.st.com/web/en/resource/technical/document/datasheet/CD00002946.pdf; Height: 1.1mm; Manufacturer_Part_Number: ESDALC6V1W5; Mouser Part Number: 511-ESDALC6V1W5; Mouser Price/Stock: https://www.mouser.com/Search/Refine.aspx?Keyword=511-ESDALC6V1W5; RS Part Number: 0250044P; RS Price/Stock: http://uk.rs-online.com/web/p/products/0250044P; Allied Price/Stock: http://www.alliedelec.com/stmicroelectronics-esdalc6v1w5/70389952/
J1-J3 J5 = 2.5mm pitch: 1881503
J4 = M80-8820742: Connector; Manufacturer_Name: Harwin; Datasheet Link: https://cdn.harwin.com/pdfs/M80-882.pdf; Manufacturer_Part_Number: M80-8820742; Mouser Part Number: 855-M80-8820742; Mouser Price/Stock: https://www.mouser.com/Search/Refine.aspx?Keyword=855-M80-8820742
J6 = 691382040004: Connector; Manufacturer_Name: Wurth Elektronik; Datasheet Link: https://www.we-online.com/catalog/datasheet/691382040004.pdf; Height: 8.1mm; Manufacturer_Part_Number: 691382040004; Mouser Part Number: 710-691382040004; Mouser Price/Stock: https://www.mouser.com/Search/Refine.aspx?Keyword=710-691382040004
J7 = 1881451: Connector; Manufacturer_Name: Phoenix Contact; Datasheet Link: https://componentsearchengine.com/Datasheets/1/1881451.pdf; Height: 8.1mm; Manufacturer_Part_Number: 1881451; Mouser Part Number: 651-1881451; Mouser Price/Stock: https://www.mouser.com/Search/Refine.aspx?Keyword=651-1881451; RS Part Number: 3579543; RS Price/Stock: https://uk.rs-online.com/web/p/products/3579543
J8 = S2B-PH-SM4-TB_LF__SN_: Connector; Manufacturer_Name: JST Sales America; Manufacturer_Part_Number: S2B-PH-SM4-TB(LF)(SN); Datasheet Link: https://www.jst-mfg.com/product/pdf/eng/ePH.pdf; Height: 6.6mm
R101-R105 = Res3: Resistor; Published: 8-Jun-2000; LatestRevisionDate: 29-May-2009; LatestRevisionNote: IPC-7351 Footprint Added.; PackageReference: J1-0603; Publisher: Altium Limited; PackageDescription: Chip Resistor
  R101-R104: Value: 22
  R105: Value: 120R

## Nets that join several sheets
+3.3V_ISO: BV100011_ControlAI (C39.1 U12.1), BV100011_ControlAO (8 pins), BV100011_ControlDI (IC1.16), BV100011_ControlDO (6 pins), BV100011_ControlRS485 (C79.1 R133.1 R134.1 U23.1), BV100011_ControlPower (C75.1 C77.2 U22.4), BV100011_ControlDI_8-15 (IC14.16), BV100011_SDCARD (7 pins), BV100011_Ethernet (17 pins), BV100011_DEBUG (J13.1), BV100011_EERAM (7 pins), BV100011_MCU144 (30 pins), BV100011_ControlConnector (J4.5)
+5V: BV100011_ControlAI (18 pins), BV100011_ControlRS485 (6 pins), BV100011_ControlPower (C70.2 C71.1 J12.4 L1.2)
+5V_ISO: BV100011_ControlTopLevel (J11.2), BV100011_ControlAI (12 pins), BV100011_ControlPower (5 pins)
EARTH: BV100011_ControlTopLevel (J9.3), BV100011_ControlDO (C33.1 C34.1)
GND: BV100011_ControlTopLevel (6 pins), BV100011_ControlAI (64 pins), BV100011_ControlDI (26 pins), BV100011_ControlDO (20 pins), BV100011_ControlRS485 (5 pins), BV100011_ControlPower (8 pins), BV100011_ControlDI_8-15 (26 pins), BV100011_ControlConnector (J7.3)
GND0: BV100011_ControlTopLevel (J11.1 J11.MP1 J11.MP2), BV100011_ControlAI (16 pins), BV100011_ControlAO (C51.2 C56.2 U19.8 U21.8), BV100011_ControlDI (9 pins), BV100011_ControlDO (23 pins), BV100011_ControlRS485 (C79.2 U23.8), BV100011_ControlPower (7 pins), BV100011_ControlDI_8-15 (9 pins), BV100011_SDCARD (6 pins), BV100011_Ethernet (21 pins), BV100011_DEBUG (IC16.2 IC17.2 J13.3 J13.5), BV100011_EERAM (5 pins), BV100011_MCU144 (39 pins), BV100011_ControlConnector (10 pins)
VBAT: BV100011_MCU144 (C88.1 SB10.2 U24.6), BV100011_ControlConnector (J8.2)
AI0: BV100011_ControlAI (D11.2 IC3.1), BV100011_ControlConnector (J3.1)
AI1: BV100011_ControlAI (D12.2 IC4.1), BV100011_ControlConnector (J3.2)
AI2: BV100011_ControlAI (D13.2 IC5.1), BV100011_ControlConnector (J3.3)
AI3: BV100011_ControlAI (D14.2 IC6.1), BV100011_ControlConnector (J3.4)
AI4: BV100011_ControlAI (D15.2 IC7.1), BV100011_ControlConnector (J3.5)
AI5: BV100011_ControlAI (D16.2 IC8.1), BV100011_ControlConnector (J3.6)
AI6: BV100011_ControlAI (D17.2 IC9.1), BV100011_ControlConnector (J3.7)
AI7: BV100011_ControlAI (D18.2 IC10.1), BV100011_ControlConnector (J3.8)
DI0: BV100011_ControlDI (D4.1 R1.2), BV100011_ControlConnector (J1.1)
DI1: BV100011_ControlDI (D3.1 R2.2), BV100011_ControlConnector (J1.2)
DI2: BV100011_ControlDI (D2.1 R9.2), BV100011_ControlConnector (J1.3)
DI3: BV100011_ControlDI (D1.1 R10.2), BV100011_ControlConnector (J1.4)
DI4: BV100011_ControlDI (D8.1 R13.2), BV100011_ControlConnector (J1.5)
DI5: BV100011_ControlDI (D7.1 R14.2), BV100011_ControlConnector (J1.6)
DI6: BV100011_ControlDI (D6.1 R21.2), BV100011_ControlConnector (J1.7)
DI7: BV100011_ControlDI (D5.1 R22.2), BV100011_ControlConnector (J1.8)
DI8: BV100011_ControlDI_8-15 (D32.1 R108.2), BV100011_ControlConnector (J2.1)
DI9: BV100011_ControlDI_8-15 (D31.1 R109.2), BV100011_ControlConnector (J2.2)
DI10: BV100011_ControlDI_8-15 (D30.1 R116.2), BV100011_ControlConnector (J2.3)
DI11: BV100011_ControlDI_8-15 (D29.1 R117.2), BV100011_ControlConnector (J2.4)
DI12: BV100011_ControlDI_8-15 (D36.1 R120.2), BV100011_ControlConnector (J2.5)
DI13: BV100011_ControlDI_8-15 (D35.1 R121.2), BV100011_ControlConnector (J2.6)
DI14: BV100011_ControlDI_8-15 (D34.1 R128.2), BV100011_ControlConnector (J2.7)
DI15: BV100011_ControlDI_8-15 (D33.1 R129.2), BV100011_ControlConnector (J2.8)
NetC15_2: BV100011_ControlDO (C15.2 IC2.29 IC2.30 R27.2), BV100011_ControlConnector (J5.5)
NetC17_2: BV100011_ControlDO (C17.2 IC2.31 IC2.32 R28.2), BV100011_ControlConnector (J5.6)
NetC18_2: BV100011_ControlDO (C18.2 IC2.33 IC2.34 R29.2), BV100011_ControlConnector (J5.7)
NetC19_2: BV100011_ControlDO (C19.2 IC2.35 IC2.36 R30.2), BV100011_ControlConnector (J5.8)
NetC20_1: BV100011_ControlDO (C20.1 IC2.21 IC2.22 R43.1), BV100011_ControlConnector (J5.1)
NetC22_1: BV100011_ControlDO (C22.1 IC2.23 IC2.24 R45.1), BV100011_ControlConnector (J5.2)
NetC24_1: BV100011_ControlDO (C24.1 IC2.25 IC2.26 R47.1), BV100011_ControlConnector (J5.3)
NetC26_1: BV100011_ControlDO (C26.1 IC2.27 IC2.28 R48.1), BV100011_ControlConnector (J5.4)
NetD19_2: BV100011_ControlAO (D19.2 D20.1), BV100011_ControlConnector (J6.4)
NetD22_2: BV100011_ControlAO (D22.2 D23.1), BV100011_ControlConnector (J6.3)
NetD24_2: BV100011_ControlAO (D24.2 D25.1), BV100011_ControlConnector (J6.2)
NetD27_2: BV100011_ControlAO (D27.2 D28.1), BV100011_ControlConnector (J6.1)
NetD38_1: BV100011_ControlRS485 (D38.1 IC15.7), BV100011_ControlConnector (J7.2 R105.2)
NetD38_2: BV100011_ControlRS485 (D38.2 IC15.6), BV100011_ControlConnector (J7.1 R105.1)
NRST: BV100011_Ethernet (U25.15), BV100011_DEBUG (R173.1), BV100011_MCU144 (B1.2 B1.3 C85.2 U24.25)
PA0: BV100011_ControlAI (U3.1 U3.2), BV100011_MCU144 (U24.34)
PA1: BV100011_Ethernet (R155.1 U25.14), BV100011_MCU144 (U24.35)
PA2: BV100011_Ethernet (R152.1 U25.12), BV100011_MCU144 (U24.36)
PA3: BV100011_ControlAI (U3.6 U3.7), BV100011_MCU144 (U24.37)
PA4: BV100011_ControlAI (U7.1 U7.2), BV100011_MCU144 (U24.40)
PA5: BV100011_ControlAI (U7.6 U7.7), BV100011_MCU144 (U24.41)
PA6: BV100011_ControlAI (U11.1 U11.2), BV100011_MCU144 (U24.42)
PA7: BV100011_Ethernet (R163.2), BV100011_MCU144 (U24.43)
PA9: BV100011_MCU144 (U24.101), BV100011_ControlConnector (R104.1)
PA10: BV100011_MCU144 (U24.102), BV100011_ControlConnector (R103.1)
PA13: BV100011_DEBUG (R168.1), BV100011_MCU144 (U24.105)
PA14: BV100011_DEBUG (R169.1), BV100011_MCU144 (U24.109)
PB1: BV100011_ControlAI (U11.6 U11.7), BV100011_MCU144 (U24.47)
PB3: BV100011_DEBUG (R170.1), BV100011_MCU144 (U24.133)
PB8: BV100011_MCU144 (U24.139), BV100011_ControlConnector (R102.1)
PB9: BV100011_MCU144 (U24.140), BV100011_ControlConnector (R101.1)
PB10: BV100011_ControlAO (U19.2 U21.2), BV100011_MCU144 (U24.69)
PB11: BV100011_ControlAO (R91.1 R97.1 U19.6 U21.6), BV100011_MCU144 (U24.70)
PB12: BV100011_ControlAO (R90.1 R96.1 U19.7 U21.7), BV100011_MCU144 (U24.73)
PB13: BV100011_Ethernet (U25.18), BV100011_MCU144 (U24.74)
PB15: BV100011_ControlAO (U19.3 U21.3), BV100011_MCU144 (U24.76)
PC0: BV100011_ControlAI (U16.1 U16.2), BV100011_MCU144 (U24.26)
PC1: BV100011_Ethernet (U25.13), BV100011_MCU144 (U24.27)
PC3: BV100011_ControlAI (U16.6 U16.7), BV100011_MCU144 (U24.29)
PC4: BV100011_Ethernet (R159.2), BV100011_MCU144 (U24.44)
PC5: BV100011_Ethernet (R160.2), BV100011_MCU144 (U24.45)
PC8: BV100011_SDCARD (CN1.7 R144.1), BV100011_MCU144 (U24.98)
PC9: BV100011_SDCARD (CN1.8 R146.1), BV100011_MCU144 (U24.99)
PC10: BV100011_SDCARD (CN1.1 R147.1), BV100011_MCU144 (U24.111)
PC11: BV100011_SDCARD (CN1.2 R143.1), BV100011_MCU144 (U24.112)
PC12: BV100011_SDCARD (CN1.5), BV100011_MCU144 (U24.113)
PD2: BV100011_SDCARD (CN1.3 R145.1), BV100011_MCU144 (U24.116)
PD3: BV100011_SDCARD (R148.1 R149.1), BV100011_MCU144 (U24.117)
PD4: BV100011_ControlRS485 (R133.2 U23.6), BV100011_MCU144 (U24.118)
PD5: BV100011_ControlRS485 (U23.2), BV100011_MCU144 (U24.119)
PD6: BV100011_ControlRS485 (U23.4), BV100011_MCU144 (U24.122)
PD8: BV100011_DEBUG (R172.1), BV100011_MCU144 (U24.77)
PD9: BV100011_DEBUG (R171.1), BV100011_MCU144 (U24.78)
PE0: BV100011_ControlDI (IC1.20 R4.2), BV100011_MCU144 (U24.141)
PE1: BV100011_ControlDI (IC1.19 R5.2), BV100011_MCU144 (U24.142)
PE2: BV100011_ControlDI (IC1.18 R6.2), BV100011_MCU144 (U24.1)
PE3: BV100011_ControlDI (IC1.17 R7.2), BV100011_MCU144 (U24.2)
PE4: BV100011_ControlDI (IC1.14 R17.2), BV100011_MCU144 (U24.3)
PE5: BV100011_ControlDI (IC1.13 R18.2), BV100011_MCU144 (U24.4)
PE6: BV100011_ControlDI (IC1.12 R19.2), BV100011_MCU144 (U24.5)
PE7: BV100011_ControlDI (IC1.11 R20.2), BV100011_MCU144 (U24.58)
PE8: BV100011_ControlDI_8-15 (IC14.20 R111.2), BV100011_MCU144 (U24.59)
PE9: BV100011_ControlDI_8-15 (IC14.19 R112.2), BV100011_MCU144 (U24.60)
PE10: BV100011_ControlDI_8-15 (IC14.18 R113.2), BV100011_MCU144 (U24.63)
PE11: BV100011_ControlDI_8-15 (IC14.17 R114.2), BV100011_MCU144 (U24.64)
PE12: BV100011_ControlDI_8-15 (IC14.14 R124.2), BV100011_MCU144 (U24.65)
PE13: BV100011_ControlDI_8-15 (IC14.13 R125.2), BV100011_MCU144 (U24.66)
PE14: BV100011_ControlDI_8-15 (IC14.12 R126.2), BV100011_MCU144 (U24.67)
PE15: BV100011_ControlDI_8-15 (IC14.11 R127.2), BV100011_MCU144 (U24.68)
PF0: BV100011_ControlDO (R34.1 R55.1), BV100011_MCU144 (U24.10)
PF1: BV100011_ControlDO (R35.1 R54.1), BV100011_MCU144 (U24.11)
PF2: BV100011_ControlDO (R36.1 R53.1), BV100011_MCU144 (U24.12)
PF3: BV100011_ControlDO (R37.1 R52.1), BV100011_MCU144 (U24.13)
PF4: BV100011_ControlDO (R38.1 R51.1), BV100011_MCU144 (U24.14)
PF5: BV100011_ControlDO (R39.1 R50.1), BV100011_MCU144 (U24.15)
PF6: BV100011_ControlDO (R40.1 R49.1), BV100011_MCU144 (U24.18)
PF7: BV100011_ControlDO (R41.1 R46.1), BV100011_MCU144 (U24.19)
PF8: BV100011_ControlDO (R31.1 R56.1), BV100011_MCU144 (U24.20)
PF9: BV100011_ControlDO (LED15.1 R42.1), BV100011_MCU144 (U24.21)
PF10: BV100011_ControlDO (LED14.1 R32.1), BV100011_MCU144 (U24.22)
PF11: BV100011_ControlDO (LED13.1 R33.1), BV100011_MCU144 (U24.49)
PF13: BV100011_EERAM (SB21.2), BV100011_MCU144 (U24.53)
PF14: BV100011_EERAM (IC18.6 R174.2), BV100011_MCU144 (U24.54)
PF15: BV100011_EERAM (IC18.5 R175.2), BV100011_MCU144 (U24.55)
PG0: BV100011_ControlAI (U12.2), BV100011_MCU144 (U24.56)
PG1: BV100011_ControlAI (U12.3), BV100011_MCU144 (U24.57)
PG11: BV100011_Ethernet (U25.16), BV100011_MCU144 (U24.126)
PG13: BV100011_Ethernet (U25.17), BV100011_MCU144 (U24.128)
VIN: BV100011_ControlTopLevel (5 pins), BV100011_ControlDO (6 pins), BV100011_ControlPower (C72.1 C73.2 J12.1)